# Altium schematic sheet Power.SchDoc
size 279 x 215 mm
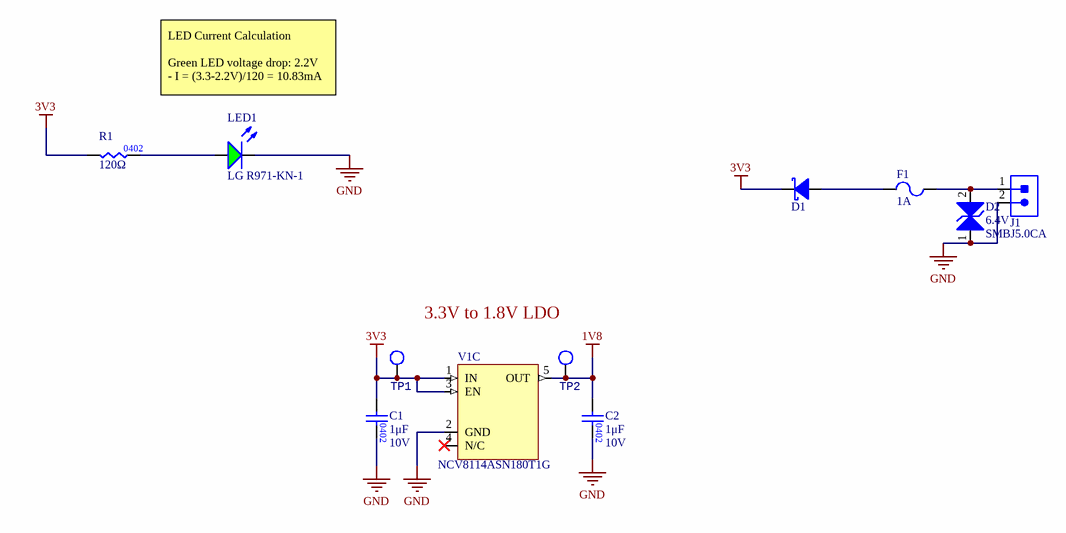
[diagram p0: Power.SchDoc]

## Parts
C1  Capacitance: 1μF  Rated DC Voltage (URdc): 10V  [CAP0402]  (hidden comment: CAP_1UF_10V_0402_X5R)
C2  Capacitance: 1μF  Rated DC Voltage (URdc): 10V  [CAP0402]  (hidden comment: CAP_1UF_10V_0402_X5R)
D1  DIO_SCHOTTKY_30V_800mA  [SOD-323_UNIDIR]  (value not drawn)
D2  Voltage - Breakdown (Min): 6.4V  Manufacturer Part Number 1: SMBJ5.0CA  [TVS_DIODE_BIDIR_SMB]  (hidden comment: TVS_DIODE_BIDIR_5V)
F1  Current Rating: 1A  [FUSE_1206]  (hidden comment: FUSE_1A_1206)
J1  CON_2POS_SCREW_TERM  [1935161]  (value not drawn)
LED1  Manufacturer Part Number 1: LG R971-KN-1  [LED_0805_GREEN]  (hidden comment: LED_GREEN)
R1  value 120Ω  [RES0402]
TP1  TESTPOINT_LOOP  [TESTPOINT_LOOP]  (value not drawn)
TP2  TESTPOINT_LOOP  [TESTPOINT_LOOP]  (value not drawn)
V1  NCV8114ASN180T1G  [1.8V_Output_LDO]  (part C of 3)

## Nets
1V8: C2.1 TP2.1 V1.5(OUT)
3V3: C1.1 D1.2(Cathode) R1.1 TP1.1 V1.1(IN) V1.3(EN)
GND: C1.2 C2.2 D2.1 J1.2 LED1.2(K) V1.2(GND)
NetD1_1: D1.1(Anode) F1.1
NetD2_2: D2.2 F1.2 J1.1
NetLED1_1: LED1.1(A) R1.2

Not connected (* = marked no-connect by the designer): V1 4(N/C)*

## Notes on the sheet
- LED Current Calculation
  Green LED voltage drop: 2.2V
  - I = (3.3-2.2V)/120 = 10.83mA
- 3.3V to 1.8V LDO
- University of Waterloo Robotics Team
- 200 University Ave W
- REV
- PROJECT
- Waterloo, Ontario, Canada
- N2L 3G1
- DOCUMENT
- ENGINEER
- REVIEWER
- MODIFIED
- SHEET
- OF

## Library data of the parts
C1 C2 = CAP_1UF_10V_0402_X5R: CAP CER 1UF 10V X5R 0402; Manufacturer: Kyocera AVX; Manufacturer Part Number: 0402ZD105MAT2A; Supplier 1: Digi-Key; Supplier Part Number 1: 478-5768-1-ND; Mounting Type: Surface Mount; Package: 0402; Temperature Characteristics Code: X5R; ComponentLink7URL: https://datasheet.ciiva.com/11531/cx5r-11531784.pdf?src-supplier=Avnet; ComponentLink7Description: https://datasheet.ciiva.com/11531/cx5r-11531784.pdf?src-supplier=Avnet
D1 = DIO_SCHOTTKY_30V_800mA: DIODE SCHOTTKY 30V 800MA USC; Manufacturer 1: Toshiba Semiconductor and Storage; Manufacturer Part Number 1: CUS08F30,H3F; Vf (Max): 220mV; Supplier 1: Digi-Key; Supplier Part Number 1: CUS08F30H3FCT-ND; Mounting Type: SMD; Vr (Max): 30V; Io: 800mA
D2 = TVS_DIODE_BIDIR_5V: TVS DIODE 5V 9.2V SMB; Manufacturer 1: Littelfuse; Package/Footprint: SMB; Supplier Part Number 1: SMBJ5.0CALFCT-ND; Supplier 1: Digi-Key; Mounting Type: SMD; Voltage - Reverse Standoff (Typ): 5V; Voltage - Clamping (Max) @ Ipp: 9.2V; Verified: No; LCSC Part #: *
F1 = FUSE_1A_1206: FUSE BOARD MOUNT 1A 125VAC 63VDC; Manufacturer 1: Bel Fuse Inc.; Manufacturer Part Number 1: C1Q 1; Package/Footprint: 1206; Supplier 1: Digi-Key; Supplier Part Number 1: 507-1077-1-ND; Mounting Type: SMD; LCSC Part #: *
J1 = CON_2POS_SCREW_TERM: TERM BLK 2POS SIDE ENTRY 5MM; Manufacturer 1: Phoenix Contact; Package/Footprint: SMD; Supplier 1: Digi-Key; Mounting Type: TH; Supplier Part Number 1: 277-1667-ND; Manufacturer Part Number 1: 1935161
LED1 = LED_GREEN: LED GREEN DIFFUSED 0805 SMD; Manufacturer 1: OSRAM; Forward Voltage Drop: 2.2V; Package/Footprint: 0805; Supplier Part Number 1: 475-1410-1-ND; Supplier 1: Digi-Key; Mounting Type: SMD
R1 = RES_120Ω_0402_5%: RES 120 OHM 5% 1/16W 0402; Manufacturer Part Number 1: RC0402JR-07120RL; Manufacturer 1: Yageo; Package/Footprint: 0402; Supplier 1: Digi-Key; Supplier Part Number 1: 311-120JRCT-ND; Mounting Type: SMD; Power: 1/16W; Tolerance: 5%
TP1 TP2 = TESTPOINT_LOOP: TESTPOINT THRUHOLE; Manufacturer 1: Keystone Electronics; Manufacturer Part Number 1: 5002; Package/Footprint: TH; Supplier Part Number 1: 36-5002-ND; Supplier 1: Digi-Key; Mounting Type: TH
V1 = 1.8V_Output_LDO: Linear Voltage Regulator IC Positive Fixed 1 Output 300mA 5-TSOP; Manufacture: onsemi; Output voltage: 1.8V; Manufacture part number: NCV8114ASN180T1G; Package: SOT-23-5 Thin, TSOT-23-5; Mounting type: Surface Mount; Supplier: Digikey; ComponentLink1Description: Datasheet; ComponentLink1URL: https://www.digikey.ca/en/products/detail/onsemi/NCV8114ASN180T1G/7066765